# EAGLE schematic 25k50_v0 (EAGLE 7.5.0)
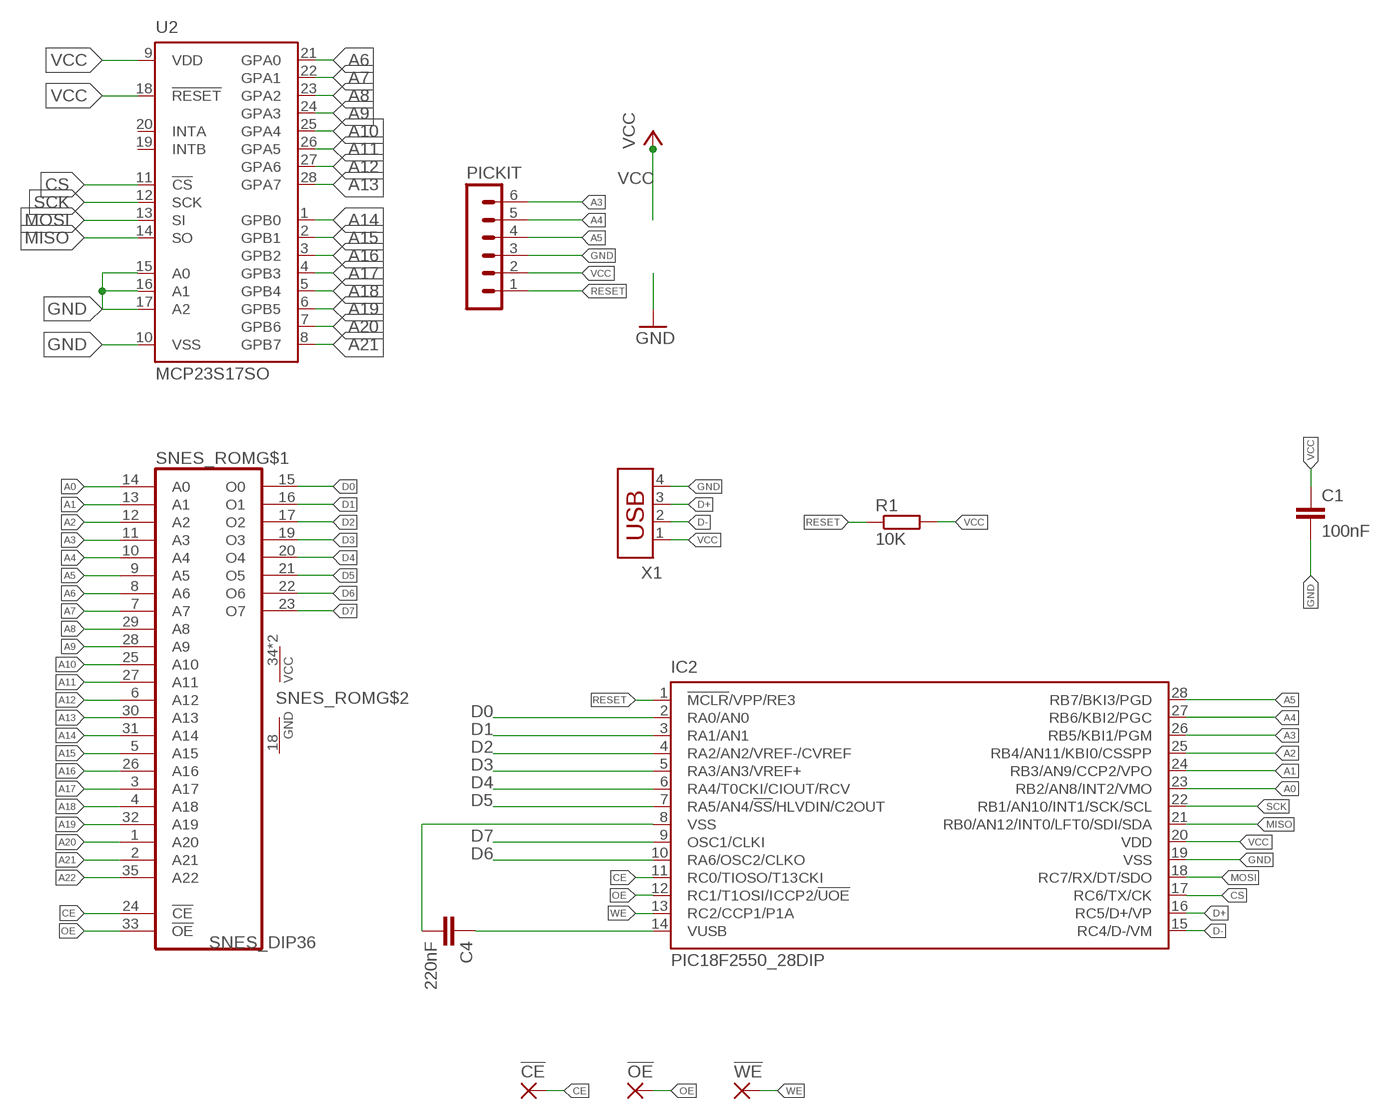
[diagram p0: schematic, sheet 1]

## Parts
!CE  2,54/1,1  [2,54/1,1]
!OE  2,54/1,1  [2,54/1,1]
!WE  2,54/1,1  [2,54/1,1]
C1  100nF  C5/2.5  [C5B2.5]
C4  220nF  C5/2.5  [C5B2.5]
IC2  PIC18F2550_28DIP  [DIL28-3]
PICKIT  MA06-1  [MA06-1]
R1  10K  R-EU_0204/7  [0204/7]
SNES_ROM  SNES_DIP36  [DIL36]
U2  MCP23S17SO  [SO28W]
X1  USB-787616  [USB]

## Nets
A0: IC2.23(RB2/AN8/INT2/VMO) SNES_ROM.14(A0)
A1: IC2.24(RB3/AN9/CCP2/VPO) SNES_ROM.13(A1)
A2: IC2.25(RB4/AN11/KBI0/CSSPP) SNES_ROM.12(A2)
A3: IC2.26(RB5/KBI1/PGM) PICKIT.6 SNES_ROM.11(A3)
A4: IC2.27(RB6/KBI2/PGC) PICKIT.5 SNES_ROM.10(A4)
A5: IC2.28(RB7/BKI3/PGD) PICKIT.4 SNES_ROM.9(A5)
A6: SNES_ROM.8(A6) U2.21(GPA0)
A7: SNES_ROM.7(A7) U2.22(GPA1)
A8: SNES_ROM.29(A8) U2.23(GPA2)
A9: SNES_ROM.28(A9) U2.24(GPA3)
A10: SNES_ROM.25(A10) U2.25(GPA4)
A11: SNES_ROM.27(A11) U2.26(GPA5)
A12: SNES_ROM.6(A12) U2.27(GPA6)
A13: SNES_ROM.30(A13) U2.28(GPA7)
A14: SNES_ROM.31(A14) U2.1(GPB0)
A15: SNES_ROM.5(A15) U2.2(GPB1)
A16: SNES_ROM.26(A16) U2.3(GPB2)
A17: SNES_ROM.3(A17) U2.4(GPB3)
A18: SNES_ROM.4(A18) U2.5(GPB4)
A19: SNES_ROM.32(A19) U2.6(GPB5)
A20: SNES_ROM.1(A20) U2.7(GPB6)
A21: SNES_ROM.2(A21) U2.8(GPB7)
A22: SNES_ROM.35(A22)
CE: !CE.1(P) IC2.11(RC0/TIOSO/T13CKI) SNES_ROM.24(!CE)
CS: IC2.17(RC6/TX/CK) U2.11(!CS)
D0: IC2.2(RA0/AN0) SNES_ROM.15(O0)
D1: IC2.3(RA1/AN1) SNES_ROM.16(O1)
D2: IC2.4(RA2/AN2/VREF-/CVREF) SNES_ROM.17(O2)
D3: IC2.5(RA3/AN3/VREF+) SNES_ROM.19(O3)
D4: IC2.6(RA4/T0CKI/CIOUT/RCV) SNES_ROM.20(O4)
D5: IC2.7(RA5/AN4/!SS!/HLVDIN/C2OUT) SNES_ROM.21(O5)
D6: IC2.10(RA6/OSC2/CLKO) SNES_ROM.22(O6)
D7: IC2.9(OSC1/CLKI) SNES_ROM.23(O7)
D+: IC2.16(RC5/D+/VP) X1.3
D-: IC2.15(RC4/D-/VM) X1.2
GND: C1.2 C4.2 IC2.8(VSS) IC2.19(VSS) PICKIT.3 U2.10(VSS) U2.15(A0) U2.16(A1) U2.17(A2) X1.4
MISO: IC2.21(RB0/AN12/INT0/LFT0/SDI/SDA) U2.14(SO)
MOSI: IC2.18(RC7/RX/DT/SDO) U2.13(SI)
N$9: C4.1 IC2.14(VUSB)
OE: !OE.1(P) IC2.12(RC1/T1OSI/ICCP2/!UOE) SNES_ROM.33(!OE)
RESET: IC2.1(!MCLR!/VPP/RE3) PICKIT.1 R1.1
SCK: IC2.22(RB1/AN10/INT1/SCK/SCL) U2.12(SCK)
VCC: C1.1 IC2.20(VDD) PICKIT.2 R1.2 U2.9(VDD) U2.18(!RESET) X1.1
WE: !WE.1(P) IC2.13(RC2/CCP1/P1A)
Unconnected: U2.19(INTB) U2.20(INTA)

## Power pins joined to a net without a drawn wire
GND: SNES_ROM.18(GND)
VCC: SNES_ROM.34(VCC) SNES_ROM.36(VCC)

## Library data of the parts
!CE !OE !WE = wirepad:2,54/1,1: THROUGH-HOLE PAD
C1 C4 = capacitor-wima:C: CAPACITOR naming: grid - package width
IC2 = microchip:PIC18F2*_28: USB Microcontrollers with nanoWatt Technology High-Performance, Enhanced Flash, 28/40/44-Pin, Source: http://ww1.microchip.com/downloads/en/devicedoc/39632c.pdf; MF: MICROCHIP; MPN: PIC18F2550-I/SP; OC_FARNELL: 1523822; OC_NEWARK: 80K6054
PICKIT = con-lstb:MA06-1: PIN HEADER; OC_FARNELL: unknown; OC_NEWARK: unknown
R1 = resistor:R-EU_: RESISTOR, European symbol
SNES_ROM = snes_rom:SNES_DIP36
U2 = microchip:MCP23S17: http://ww1.microchip.com/downloads/en/DeviceDoc/21952a.pdf Source: http://ww1.microchip.com/downloads/en/DeviceDoc/21952a.pdf; MF: MICROCHIP; MPN: MCP23S17-E/SO; OC_FARNELL: unknown; OC_NEWARK: 31K2950
X1 = con-amp:USB-787616: AMP connector